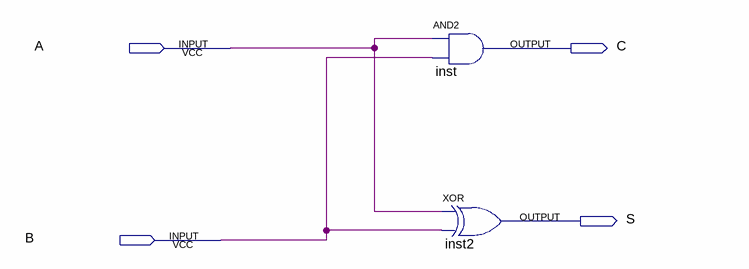
[diagram p0: schematic sheet]
// Quartus schematic adder.bdf as structural Verilog: 2 symbols, 4 pins
module adder (
  input  A,
  input  B,
  output C,
  output S
);

  and inst (C, A, B);
  xor inst2 (S, A, B);
endmodule
